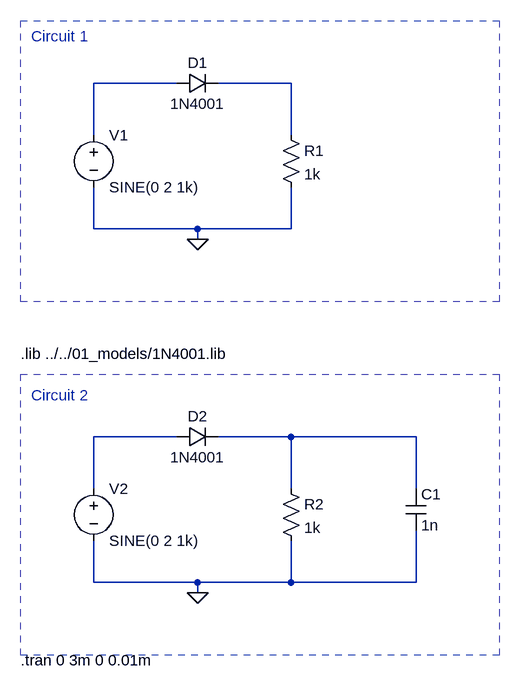
[diagram p0: schematic diodechar_01_02_03_trans_vs_vr_vc.asc]
diodechar_01_02_03_trans_vs_vr_vc.asc, the LTspice schematic file:
Version 4
SHEET 1 880 680
WIRE 112 -496 -16 -496
WIRE 288 -496 176 -496
WIRE -16 -416 -16 -496
WIRE 288 -416 288 -496
WIRE -16 -272 -16 -336
WIRE 144 -272 -16 -272
WIRE 288 -272 288 -336
WIRE 288 -272 144 -272
WIRE 144 -256 144 -272
WIRE 112 48 -16 48
WIRE 288 48 176 48
WIRE 480 48 288 48
WIRE -16 128 -16 48
WIRE 288 128 288 48
WIRE 480 128 480 48
WIRE -16 272 -16 208
WIRE 144 272 -16 272
WIRE 288 272 288 208
WIRE 288 272 144 272
WIRE 480 272 480 192
WIRE 480 272 288 272
WIRE 144 288 144 272
FLAG 144 288 0
FLAG 144 -256 0
SYMBOL diode 112 64 R270
WINDOW 0 32 32 VTop 2
WINDOW 3 0 32 VBottom 2
SYMATTR InstName D2
SYMATTR Value 1N4001
SYMBOL res 272 112 R0
SYMATTR InstName R2
SYMATTR Value 1k
SYMBOL voltage -16 112 R0
WINDOW 123 0 0 Left 2
WINDOW 39 0 0 Left 2
SYMATTR InstName V2
SYMATTR Value SINE(0 2 1k)
SYMBOL cap 464 128 R0
SYMATTR InstName C1
SYMATTR Value 1n
SYMBOL diode 112 -480 R270
WINDOW 0 32 32 VTop 2
WINDOW 3 0 32 VBottom 2
SYMATTR InstName D1
SYMATTR Value 1N4001
SYMBOL res 272 -432 R0
SYMATTR InstName R1
SYMATTR Value 1k
SYMBOL voltage -16 -432 R0
WINDOW 123 0 0 Left 2
WINDOW 39 0 0 Left 2
SYMATTR InstName V1
SYMATTR Value SINE(0 2 1k)
TEXT -112 -568 Left 2 ;Circuit 1
TEXT -112 -16 Left 2 ;Circuit 2
TEXT -128 392 Left 2 !.tran 0 3m 0 0.01m
TEXT -128 -80 Left 2 !.lib ../../01_models/1N4001.lib
RECTANGLE Normal 608 384 -128 -48 2
RECTANGLE Normal 608 -160 -128 -592 2

The netlist it stands for:
* diodechar_01_02_03_trans_vs_vr_vc.asc
D2 N003 N004 1N4001
R2 N004 0 1k
V2 N003 0 SINE(0 2 1k)
C1 N004 0 1n
D1 N001 N002 1N4001
R1 N002 0 1k
V1 N001 0 SINE(0 2 1k)
.model D D
.lib standard.dio
* Circuit 1
* Circuit 2
.tran 0 3m 0 0.01m
.lib ../../01_models/1N4001.lib
.backanno
.end